# EAGLE design Xbee_Shield_Nucleo_V01 (EAGLE 9.2.2)
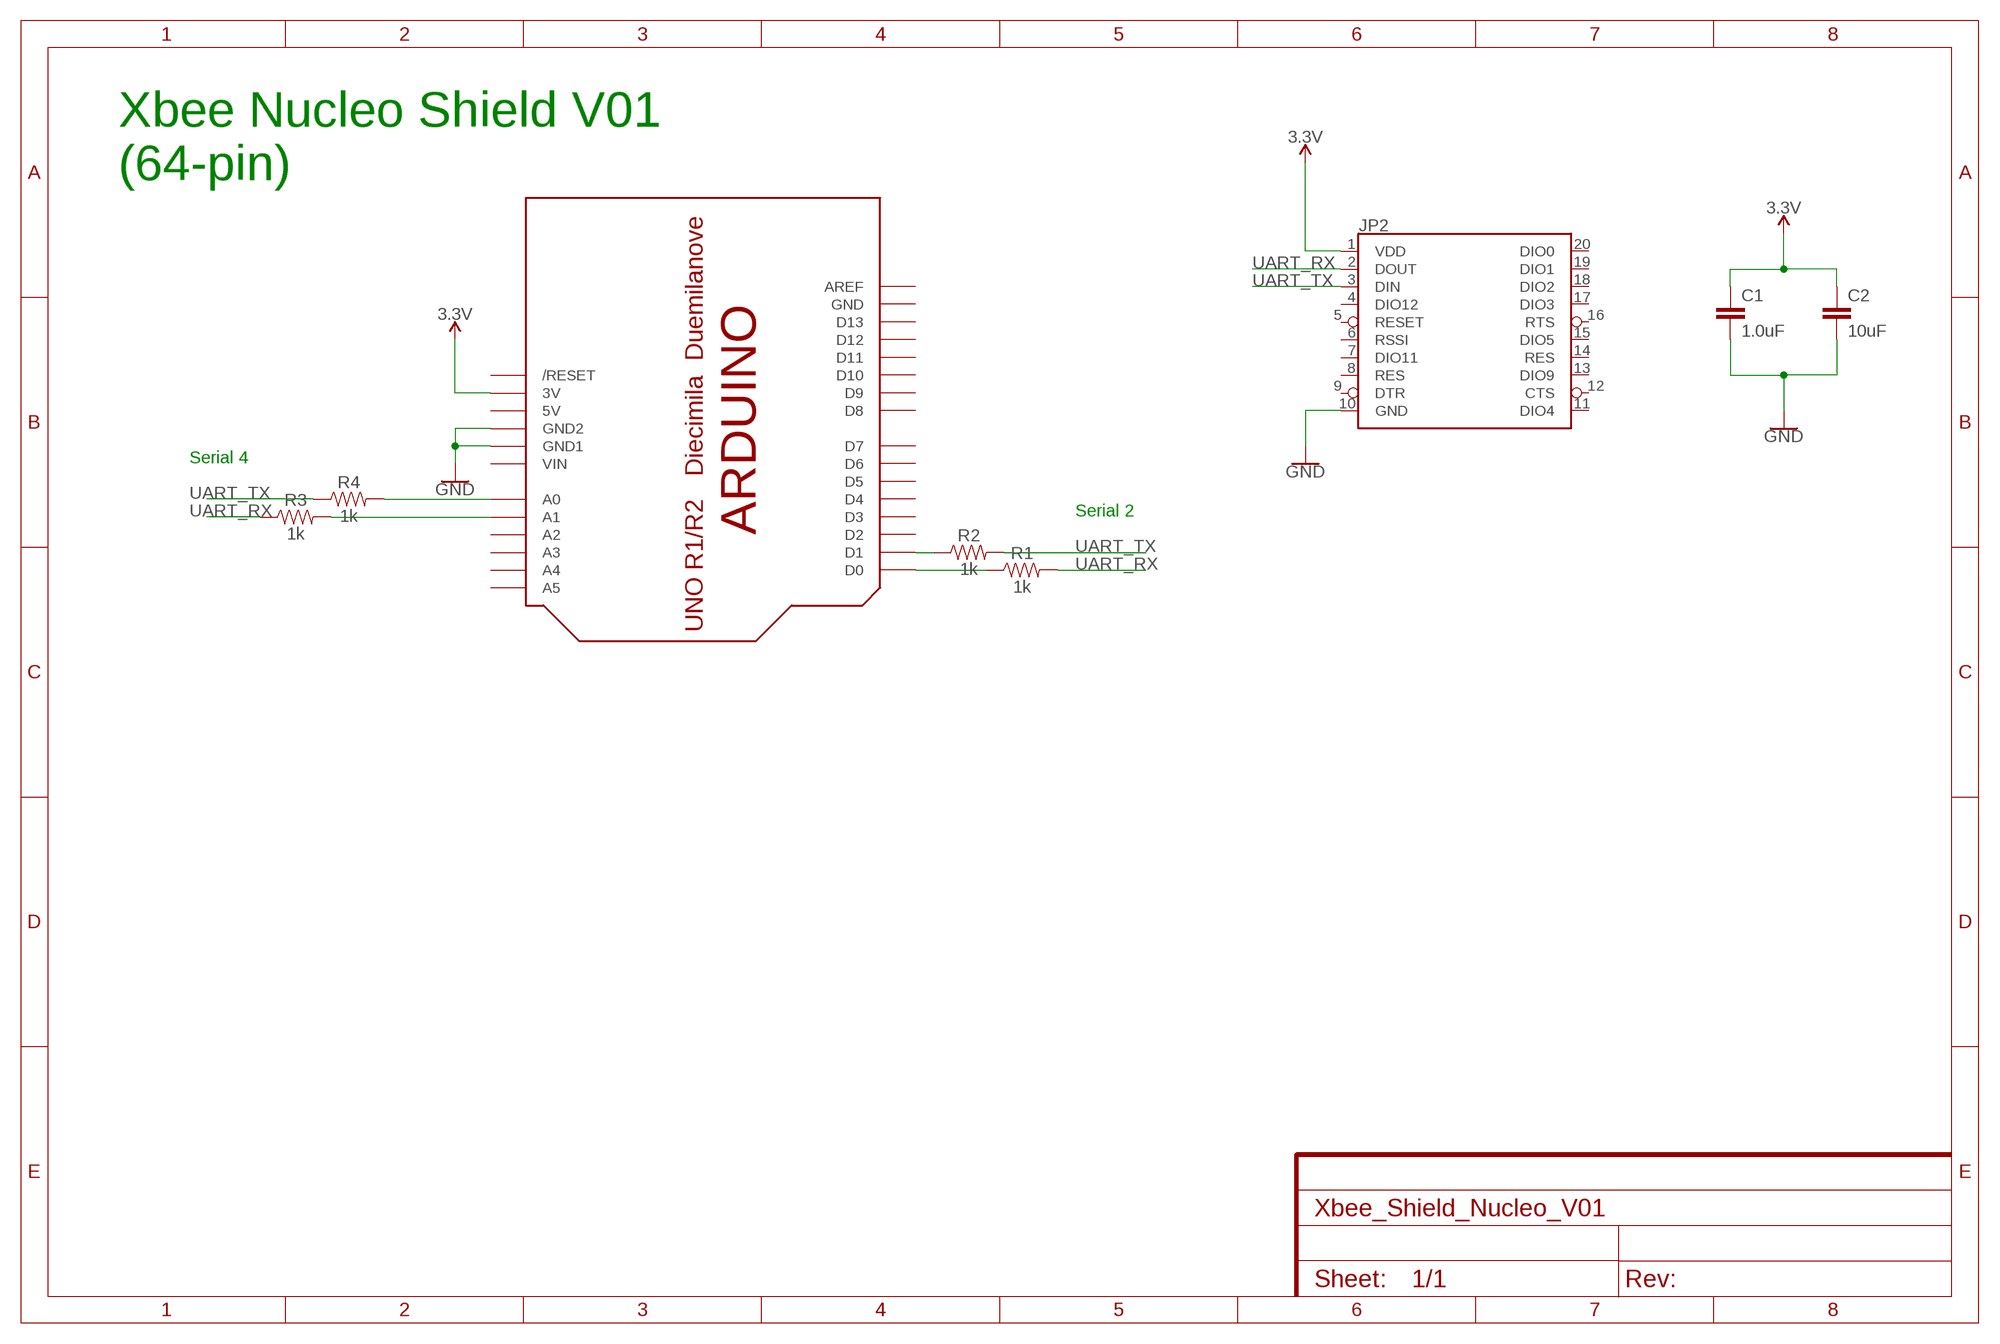
[diagram p0: schematic, sheet 1]

## Parts
C1  1.0uF  1.0UF-0805-25V-10%  [0805]
C2  10uF  1.0UF-0805-25V-10%  [0805]
JP2  XBEESILK  [XBEE-SILK]
R1  1k  RESISTOR0805  [0805]
R2  1k  RESISTOR0805  [0805]
R3  1k  RESISTOR0805  [0805]
R4  1k  RESISTOR0805  [0805]
U1  ARDUINO-NOHOLE  [ARDUINO-NOHOLE]

## Nets
3.3V: C1.1 C2.1 JP2.1(VDD) U1.3V
GND: C1.2 C2.2 JP2.10(GND) U1.GND1 U1.GND2
N$1: R1.1 U1.D0
N$2: R2.1 U1.D1
N$5: R4.2 U1.A0
N$6: R3.2 U1.A1
UART_RX: JP2.2(DOUT) R1.2 R3.1
UART_TX: JP2.3(DIN) R2.2 R4.1
Unconnected: JP2.4(DIO12) JP2.5(RESET) JP2.6(RSSI) JP2.7(DIO11) JP2.8(RES) JP2.9(DTR) JP2.11(DIO4) JP2.12(CTS) JP2.13(DIO9) JP2.14(RES) JP2.15(DIO5) JP2.16(RTS) JP2.17(DIO3) JP2.18(DIO2) JP2.19(DIO1) JP2.20(DIO0) U1.A2 U1.A3 U1.A4 U1.A5 U1.AREF U1.D2 U1.D3 U1.D4 U1.D5 U1.D6 U1.D7 U1.D8 U1.D9 U1.D10 U1.D11 U1.D12 U1.D13 U1.RESET(/RESET)

## Notes on the sheet
- Xbee Nucleo Shield V01
  (64-pin)
- Serial 4
- Serial 2

## Power pins joined to a net without a drawn wire
5V: U1.5V
GND: U1.GND
VIN: U1.VIN

## Library data of the parts
C1 = SparkFun-Capacitors:1.0UF: 1µF ceramic capacitors A capacitor is a passive two-terminal electrical component used to store electrical energy temporarily in an electric field.; PROD_ID: CAP-08064
C2 = SparkFun-Capacitors:1.0UF: 1µF ceramic capacitors A capacitor is a passive two-terminal electrical component used to store electrical energy temporarily in an electric field.; PROD_ID: CAP-08064; VALUE: 1.0uF
JP2 = SparkFun-RF:XBEE: Digi XBee and XBee Pro XBees are tiny blue chips that can communicate wirelessly with each other. They can do simple things, like replacing a couple of wires in serial communication, which is nice when you want to make a remote for your paintball vehicle. SparkFun Products SparkFun XBee Buying Guide <https://www.sparkfun.com/pages/xbee_guide> SparkFun XBee Explorer USB <https://www.sparkfun.com/products/11812> (WRL-11812) Breakout Board for XBee Module <https://www.sparkfun.com/products/8276> (WRL-8276) SparkFun XBee Explorer Regulated <https://www.sparkfun.com/products/11373> (WRL-11373) SparkFun XBee Explorer Dongle <https://www.sparkfun.com/products/11697> (WRL-11697) SparkFun XBee Shield <https://www.sparkfun.com/products/12847> (WRL-12847) SparkFun XBee Explorer Serial <https://www.sparkfun.com/products/13225> (WRL-13225)
R1-R4 = SparkFun-Resistors:RESISTOR: Generic Resistor Package
U1 = adafruit:ARDUINO: Arduino Diecimila/Duemilanove Make a shield with ease, this package has all the named pins as well as the two mounting drill holes and an outline of the USB and DC power connector. The outline is on the DIMENSION layer, so if your board house uses it they will cut the outline to match. http://www.ladyada.net/library/pcb/eaglelibrary.html

## Net classes
0 default: width 0.254 mm, drill 0.4 mm, clearance 0.203 mm

## Board
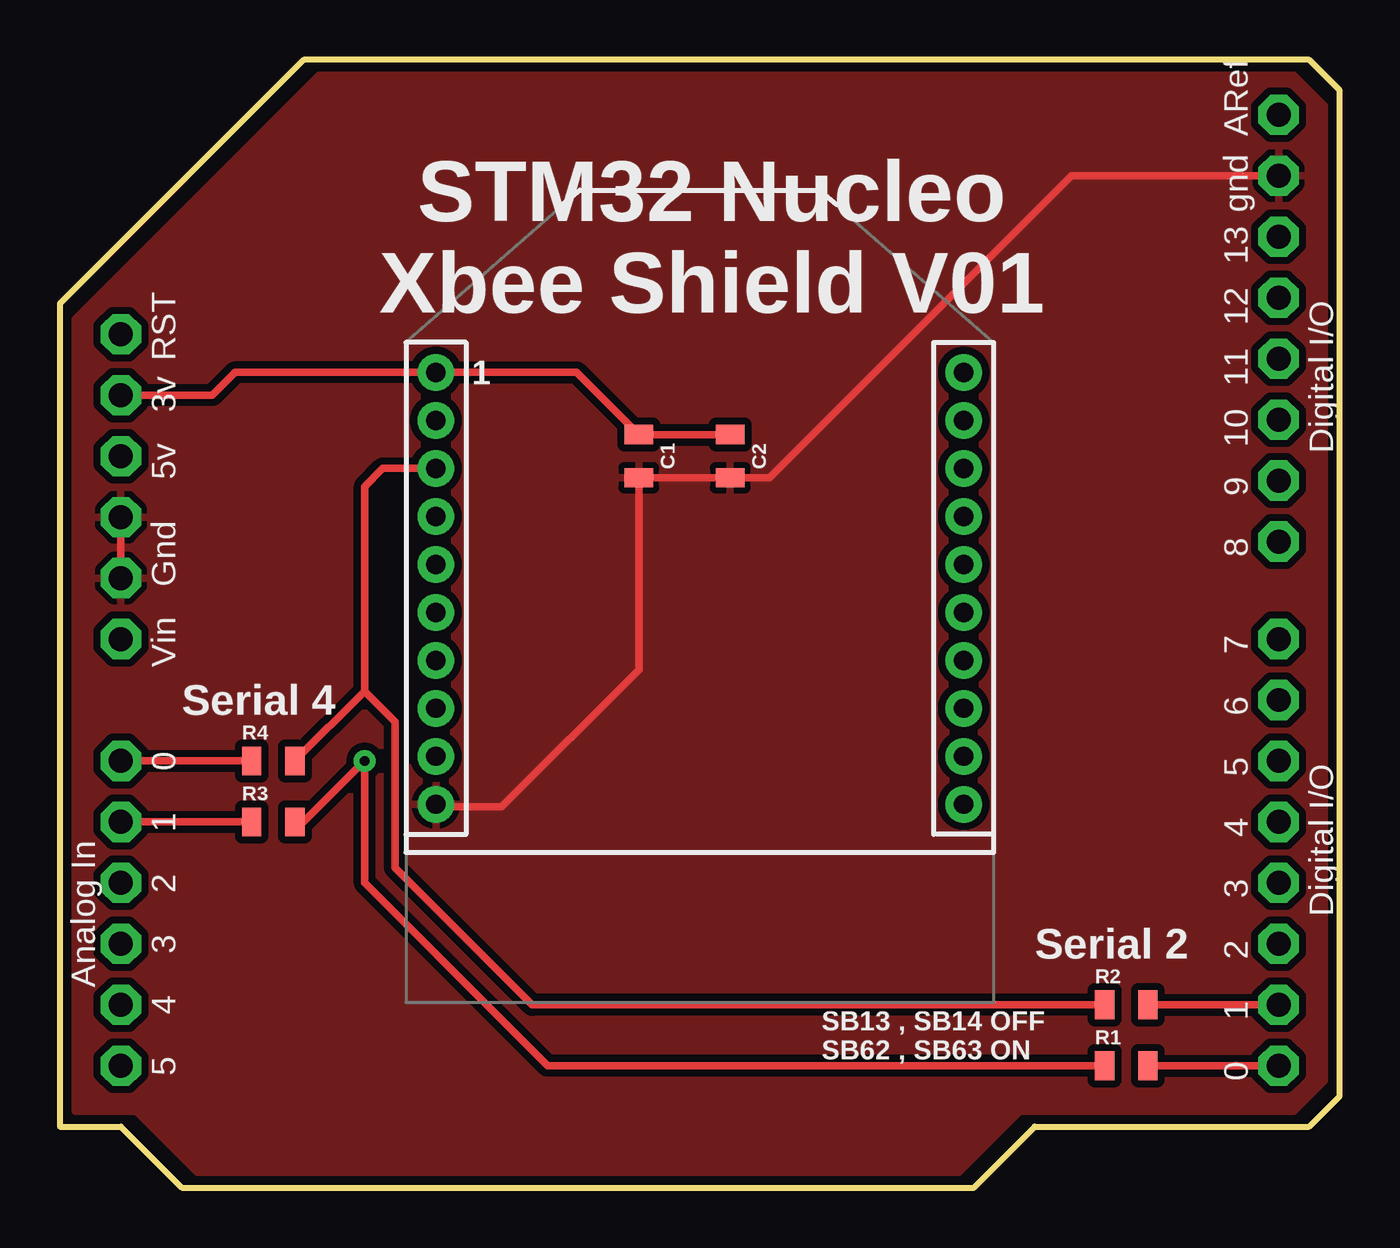
[diagram p1: board, top side]
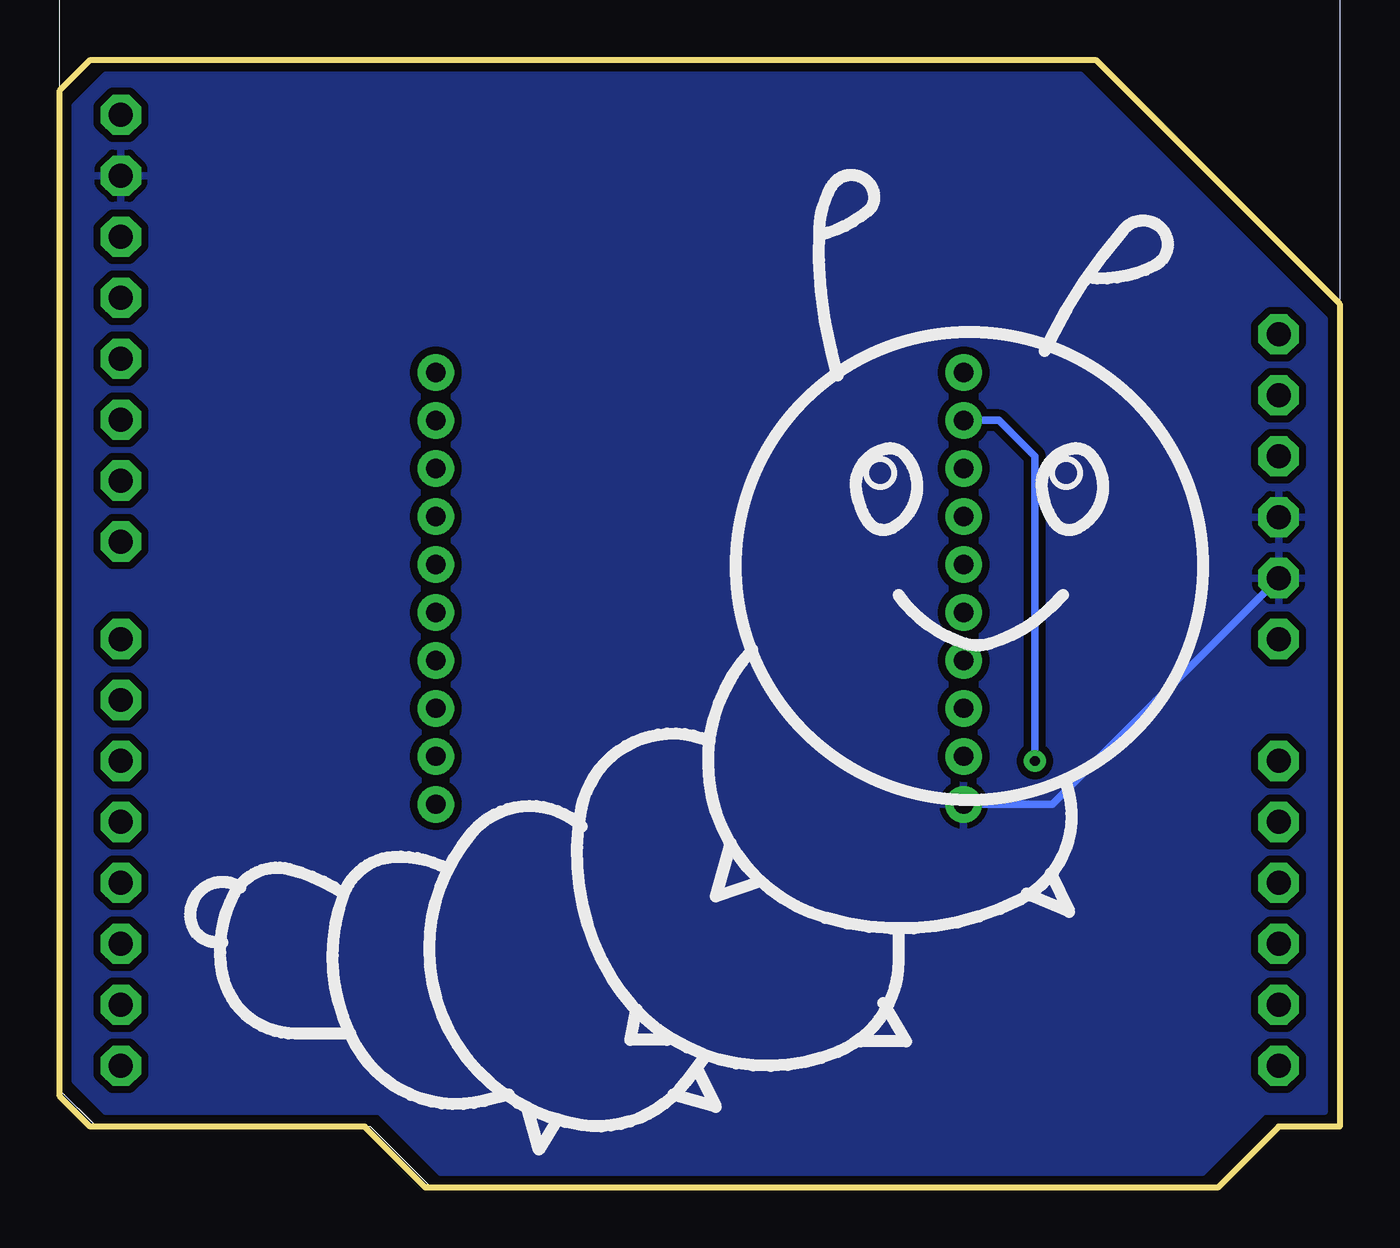
[diagram p2: board, bottom side, seen from below]

Size 53.34 x 46.99 mm. Coordinates in mm from the lower left corner, seen from the top.
Outline: 0,2.54 2.54,2.54 5.08,0 38.1,0 40.64,2.54 52.07,2.54 53.34,3.81 53.34,45.72 52.07,46.99 10.16,46.99 0,36.83 0,2.54
Copper layers (1*16): Top 0.035mm / dielectric 1.5mm / Bottom 0.035mm
Design rules "Modified-SparkFun-2-layer-STANDARD": minimum track width 10mil, minimum drill 15mil, track to track 10mil, track to pad 8mil, pad to pad 8mil, via to via 10mil, smd to smd 8mil, copper to edge 8mil, drill to drill 8mil, minimum pad ring 10mil, minimum via ring 10mil, stop-mask expansion 4mil, vias tented up to drill 25mil, thermal gap 10mil

### Footprints (pad centres in the part's own frame; a part is rotated, then mirrored left to right if it is on the bottom)
0805 = smd 0.8 x 1.2: 1 -0.9,0; 2 0.9,0
XBEE-SILK = drill 0.8 pad 1.524: 1 -11,20; 2 -11,18; 3 -11,16; 4 -11,14; 5 -11,12; 6 -11,10; 7 -11,8; 8 -11,6; 9 -11,4; 10 -11,2; 11 11,2; 12 11,4; 13 11,6; 14 11,8; 15 11,10; 16 11,12; 17 11,14; 18 11,16; 19 11,18; 20 11,20
ARDUINO-NOHOLE = drill 1 pad 1.676 octagon: 3V 35.56,2.54; 5V 38.1,2.54; A0 50.8,2.54; A1 53.34,2.54; A2 55.88,2.54; A3 58.42,2.54; A4 60.96,2.54; A5 63.5,2.54; AREF 23.876,50.8; D0 63.5,50.8; D1 60.96,50.8; D2 58.42,50.8; D3 55.88,50.8; D4 53.34,50.8; D5 50.8,50.8; D6 48.26,50.8; D7 45.72,50.8; D8 41.656,50.8; D9 39.116,50.8; D10 36.576,50.8; D11 34.036,50.8; D12 31.496,50.8; D13 28.956,50.8; GND 26.416,50.8; GND1 43.18,2.54; GND2 40.64,2.54; RESET 33.02,2.54; VIN 45.72,2.54

### Placement (x,y rotation side)
C1  24.13,30.48 270 top
C2  27.94,30.48 270 top
JP2  26.67,13.97 0 top
R1  44.45,5.08 180 top
R2  44.45,7.62 180 top
R3  8.89,15.24 180 top
R4  8.89,17.78 180 top
U1  0,68.58 270 top

### Tracks (layer width: path | path; a pad name or v marks a point on that pad's centre or on a via)
3.3V
  Top 0.305: U1.3V 6.35,33.02 7.3,33.97 JP2.1 21.54,33.97 C1.1 C2.1
GND
  Top 0.305: U1.GND2 U1.GND1 | JP2.10 15.77,15.88 18.41,15.88 24.13,21.59 C1.2 C2.2 29.58,29.58 42.16,42.16 U1.GND
  Bottom 0.305: U1.GND1 11.97,15.97 JP2.10
  pour Top (isolate 0.305): 0.64,3.17 3.17,3.17 5.71,0.64 37.47,0.64 40.01,3.17 51.44,3.17 52.7,4.45 52.7,45.09 51.44,46.35 10.79,46.35 0.64,36.2
  pour Bottom (isolate 0.305): 0.64,3.17 3.17,3.17 5.71,0.64 37.47,0.64 40.01,3.17 51.44,3.17 52.7,4.45 52.7,45.09 51.44,46.35 10.79,46.35 0.64,36.2
N$1
  Top 0.305: R1.1 U1.D0
N$2
  Top 0.305: R2.1 U1.D1
N$5
  Top 0.305: U1.A0 R4.2
N$6
  Top 0.305: U1.A1 R3.2
UART_RX  (via drill 0.4)
  Top 0.305: R3.1 10.16,15.24 v12.7,17.78 12.7,12.7 20.32,5.08 R1.2
  Bottom 0.305: v12.7,17.78 12.7,30.48 14.19,31.97 JP2.2
UART_TX
  Top 0.305: R4.1 12.7,20.69 | 12.7,20.69 12.7,29.21 13.46,29.97 JP2.3 | R2.2 19.68,7.62 13.97,13.34 13.97,19.42 12.7,20.69

### Text on the board
tNames: STM32 Nucleo / Xbee Shield V01 | Serial 4 | Serial 2 | SB13 , SB14 OFF / SB62 , SB63 ON